# EasyEDA Pro project A320RMPv1.epro

# Board PCB8
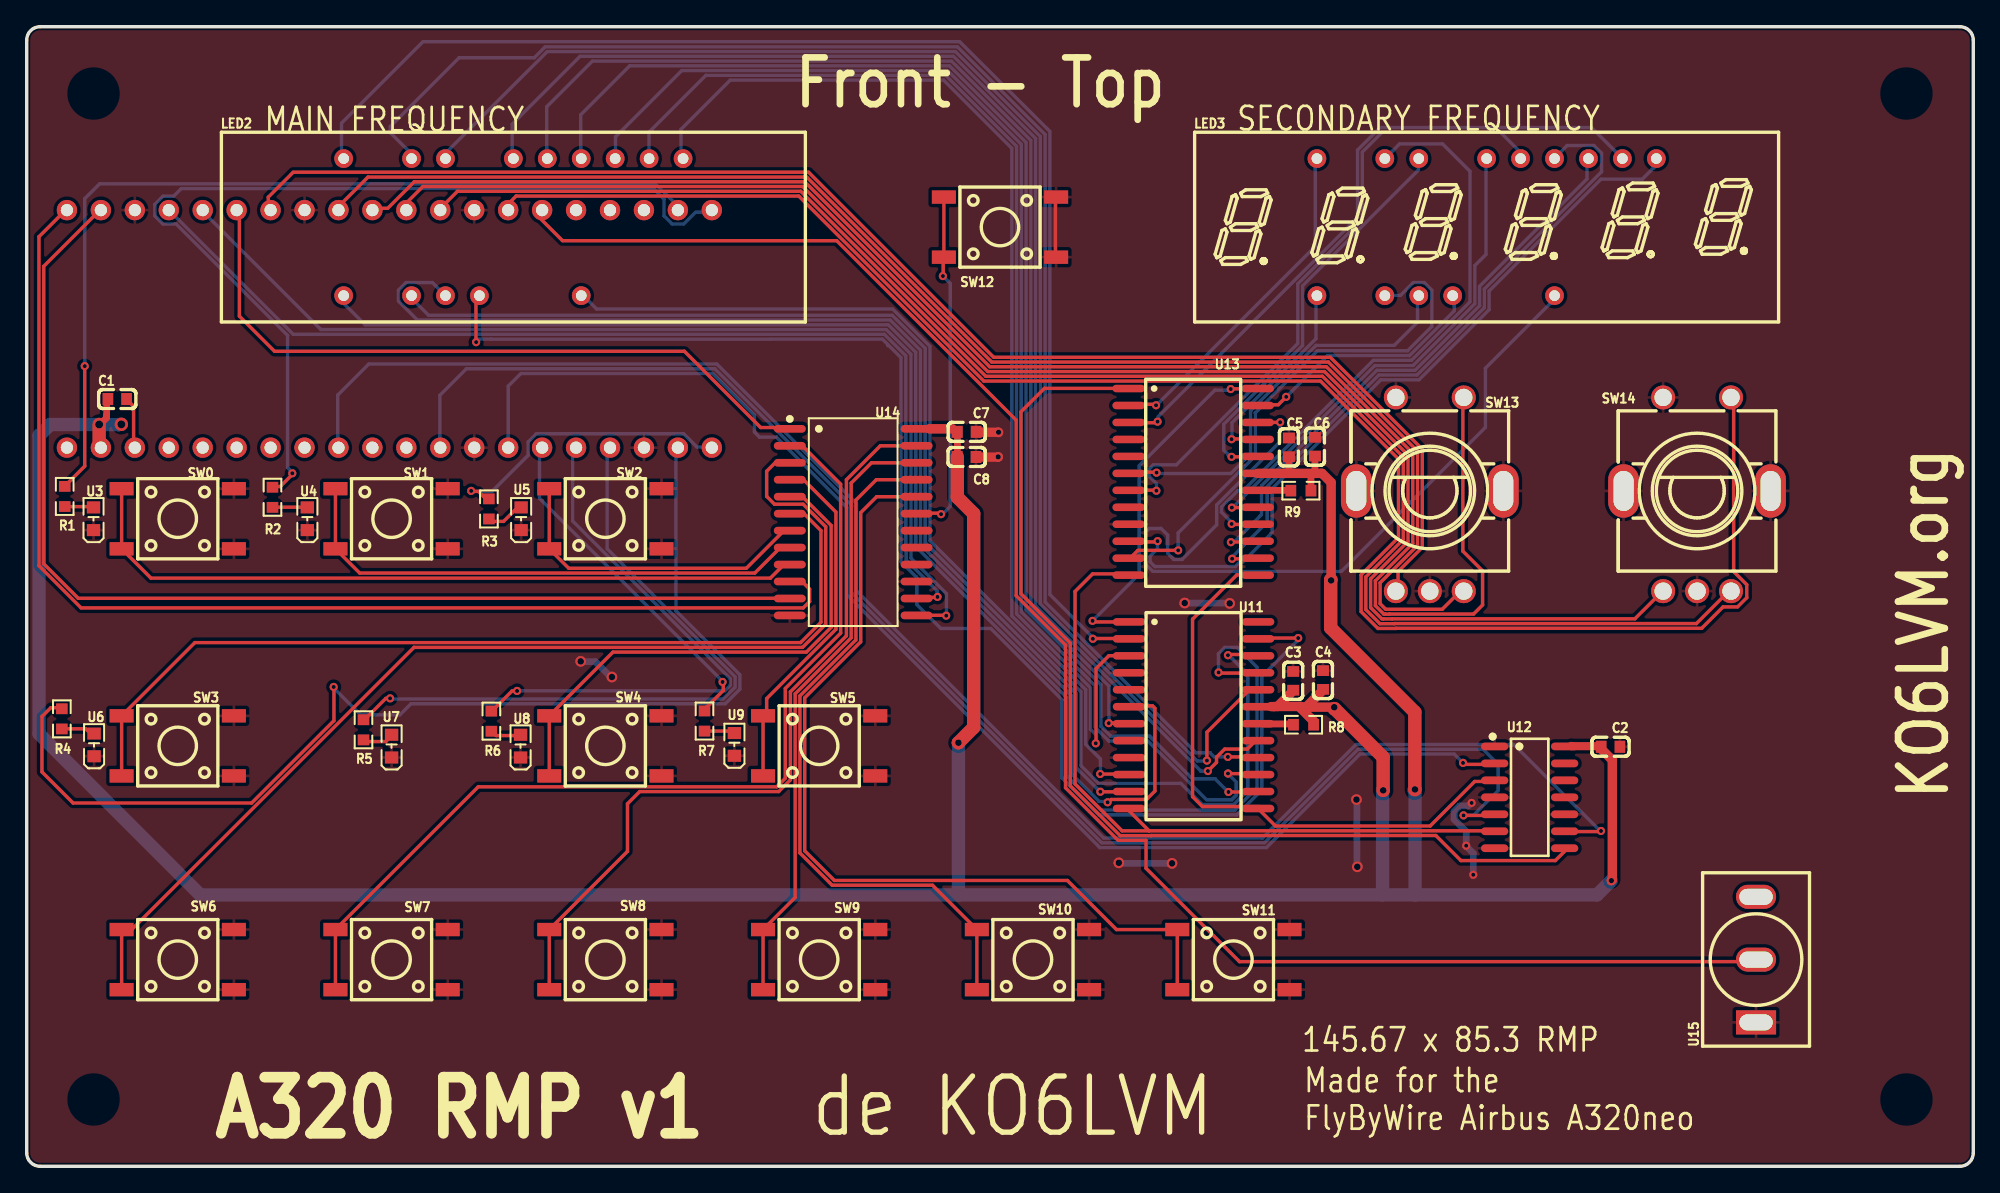
[diagram p0: board, top side]
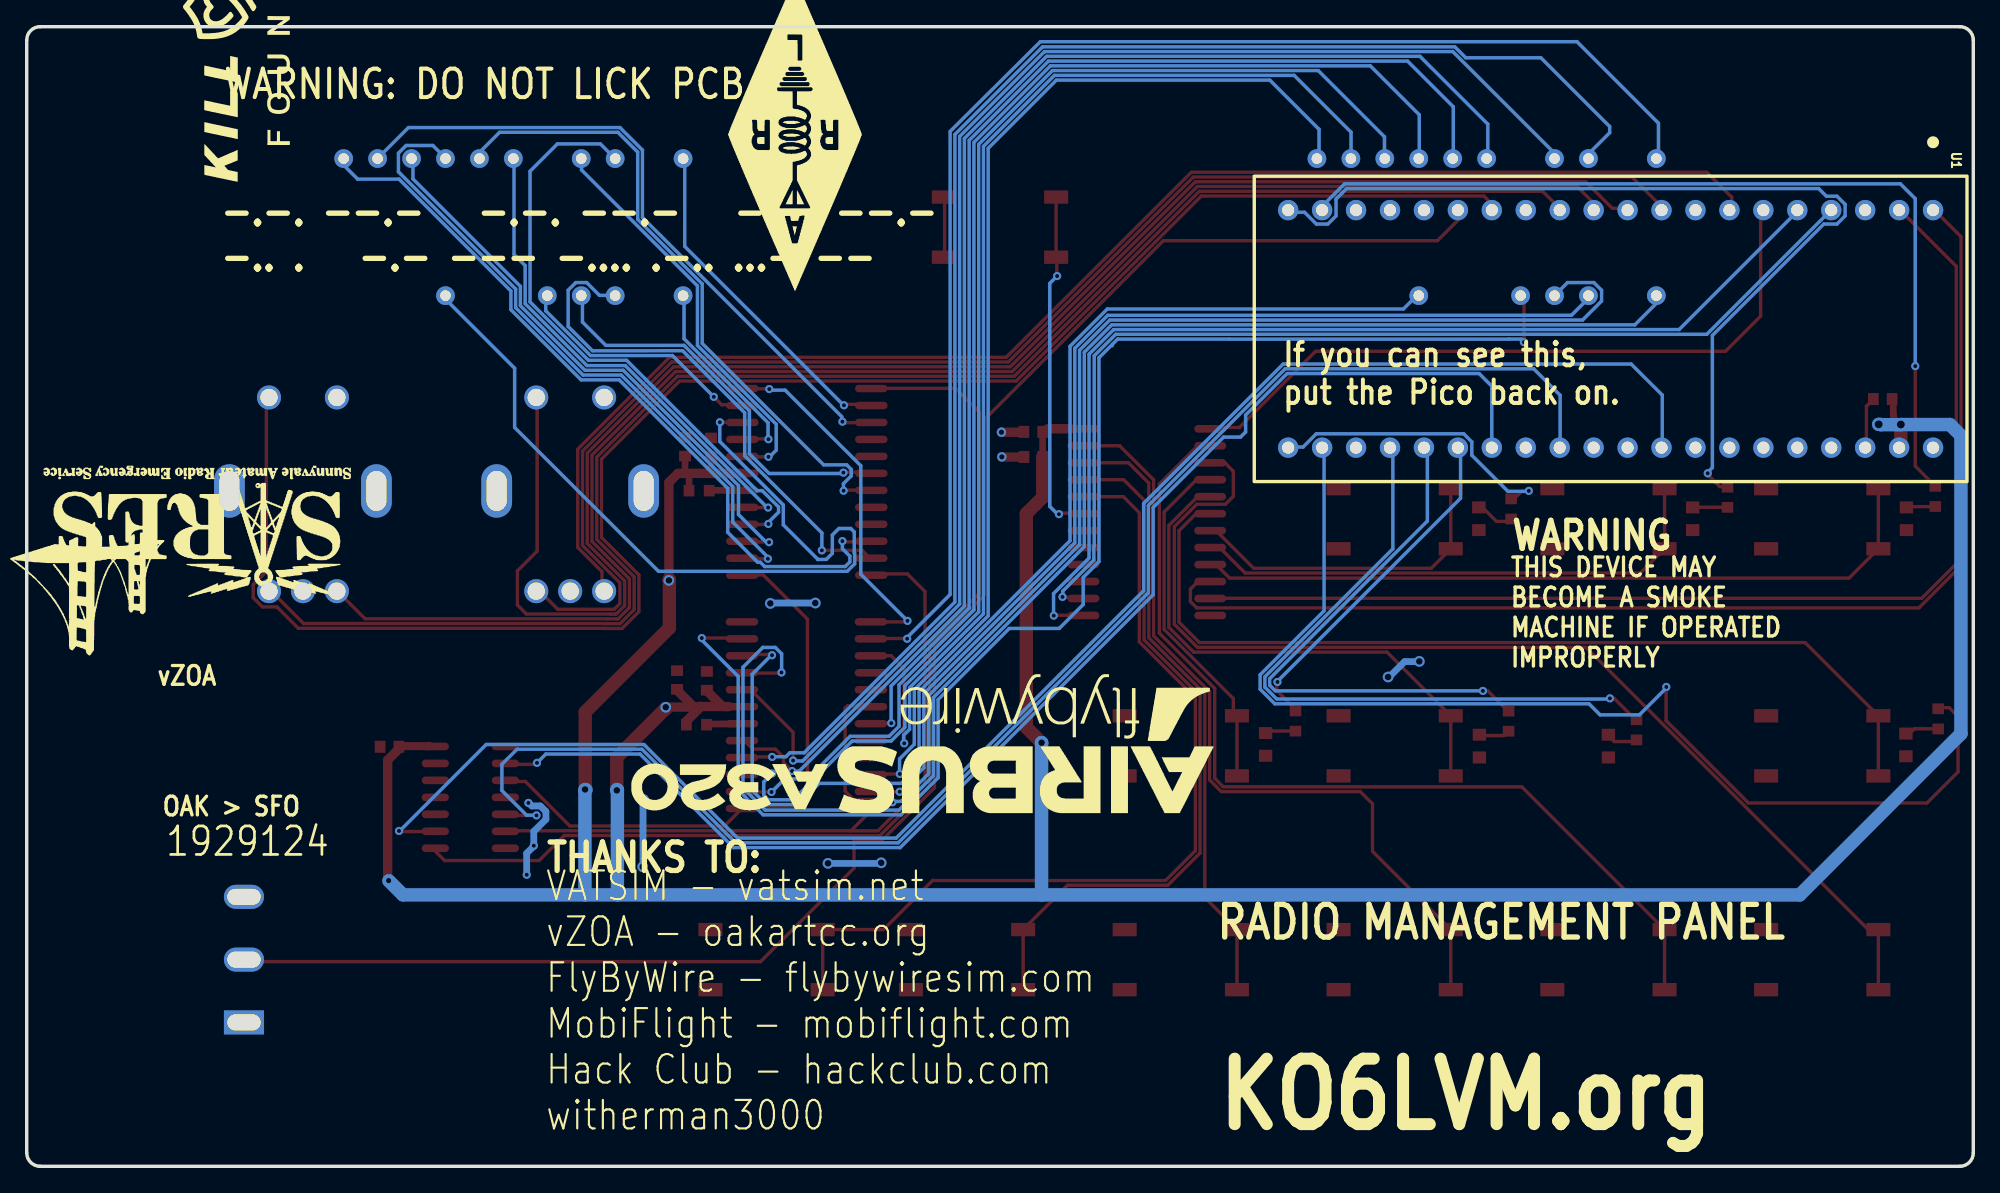
[diagram p1: board, bottom side, seen from below]

Outline 145.67 x 85.3 mm; copper layers: Top Layer, Bottom Layer. Coordinates in mm from the lower left corner of the outline.
Outline path: 0,84.3 0,1 arc(0.29,0.29) 1,0 144.67,0 arc(145.38,0.29) 145.67,1 145.67,84.3 arc(145.38,85.01) 144.67,85.3 1,85.3 arc(0.29,85.01) 0,84.3
Stack: Top Layer 0.035mm / Dielectric1 1.51mm FR4 er 4.5 / Bottom Layer 0.035mm

## Design rules (mm)
template: JLCPCB Capability(Two Layers Board)
spacing copperThickness1oz (default): track to track 0.102, other pairs 0.152 to 0.3
spacing copperThickness2oz: track to track 0.203, other pairs 0.152 to 0.3
track width copperThickness1oz (default): min 0.127, default 0.254, max 2.54
track width copperThickness2oz: min 0.203, default 0.254, max 2.54
differential pair differentialPair (default): width min 0.127, default 0.254, max 2.54; gap min 0.152, default 0.152
via viaSize (default): diameter min 0.5, default 0.61, max 10; hole min 0.3, default 0.305, max 6.3

## Placement (name value [footprint] x y rotation side)
C1  10uF  [C0603]  6.77 57.43 0 top
C2  0.1uF  [C0603]  118.52 31.4 180 top
C3  0.1uF  [C0603]  94.78 36.34 270 top
C4  10uF  [C0603]  97 36.4 270 top
C5  0.1uF  [C0603]  94.46 53.82 270 top
C6  10uF  [C0603]  96.41 53.86 270 top
C7  0.1uF  [C0603]  70.35 54.97 180 top
C8  10uF  [C0603]  70.34 53.09 180 top
LED2  FJ3661AH  [LED-SEG-TH_14P-L43.7-W14.2P2.54-S10.26-BL]  36.42 70.3 0 top
LED3  FJ3661AH  [LED-SEG-TH_14P-L43.7-W14.2P2.54-S10.26-BL]  109.25 70.3 0 top
R1  -  [R0603]  2.84 50.14 270 top
R2  -  [R0603]  18.39 50.08 270 top
R3  -  [R0603]  34.59 49.21 270 top
R4  -  [R0603]  2.63 33.49 90 top
R5  -  [R0603]  25.2 32.67 270 top
R6  -  [R0603]  34.77 33.32 270 top
R7  -  [R0603]  50.72 33.33 270 top
R8  22K  [R0603]  95.55 33.05 0 top
R9  22K  [R0603]  95.35 50.57 0 top
SW0  HX-6x6x7.3-TP FT square button  [SW-SMD_4P-L6.0-W6.0-P4.50-LS9.0-H7.3]  11.3 48.47 0 top
SW1  HX-6x6x7.3-TP FT square button  [SW-SMD_4P-L6.0-W6.0-P4.50-LS9.0-H7.3]  27.3 48.47 0 top
SW2  HX-6x6x7.3-TP FT square button  [SW-SMD_4P-L6.0-W6.0-P4.50-LS9.0-H7.3]  43.3 48.47 0 top
SW3  HX-6x6x7.3-TP FT square button  [SW-SMD_4P-L6.0-W6.0-P4.50-LS9.0-H7.3]  11.3 31.47 0 top
SW4  HX-6x6x7.3-TP FT square button  [SW-SMD_4P-L6.0-W6.0-P4.50-LS9.0-H7.3]  43.3 31.47 0 top
SW5  HX-6x6x7.3-TP FT square button  [SW-SMD_4P-L6.0-W6.0-P4.50-LS9.0-H7.3]  59.3 31.47 0 top
SW6  HX-6x6x7.3-TP FT square button  [SW-SMD_4P-L6.0-W6.0-P4.50-LS9.0-H7.3]  11.3 15.47 0 top
SW7  HX-6x6x7.3-TP FT square button  [SW-SMD_4P-L6.0-W6.0-P4.50-LS9.0-H7.3]  27.3 15.47 0 top
SW8  HX-6x6x7.3-TP FT square button  [SW-SMD_4P-L6.0-W6.0-P4.50-LS9.0-H7.3]  43.3 15.47 0 top
SW9  HX-6x6x7.3-TP FT square button  [SW-SMD_4P-L6.0-W6.0-P4.50-LS9.0-H7.3]  59.3 15.47 0 top
SW10  HX-6x6x7.3-TP FT square button  [SW-SMD_4P-L6.0-W6.0-P4.50-LS9.0-H7.3]  75.3 15.47 0 top
SW11  HX-6x6x7.3-TP FT square button  [SW-SMD_4P-L6.0-W6.0-P4.50-LS9.0-H7.3]  90.3 15.47 0 top
SW12  HX-6x6x7.3-TP FT square button  [SW-SMD_4P-L6.0-W6.0-P4.50-LS9.0-H7.3]  72.84 70.3 0 top
SW13  EC11E15244B2  [SW-TH_EC11XXXXXXXX]  105 50.3 0 top
SW14  EC11E15244B2  [SW-TH_EC11XXXXXXXX]  125 50.3 0 top
U1  -  [Raspberry Pi Pico]  25.87 61.41 270 bottom
U3  YLED0603G  [LED0603-FD]  5 48.47 270 top
U4  YLED0603G  [LED0603-FD]  21 48.47 270 top
U5  YLED0603G  [LED0603-FD]  37 48.47 270 top
U6  YLED0603G  [LED0603-FD]  5.04 31.54 270 top
U7  YLED0603G  [LED0603-FD]  27.31 31.45 270 top
U8  YLED0603G  [LED0603-FD]  36.96 31.45 270 top
U9  YLED0603G  [LED0603-FD]  52.96 31.58 270 top
U11  MAX7219M/TR  [SOP-24_L15.4-W7.5-P1.27-LS10.4-BL]  87.32 33.77 270 top
U12  SN74AHCT125DR  [SOIC-14_L8.7-W3.9-P1.27-LS6.0-BL]  112.47 27.62 270 top
U13  MAX7219M/TR  [SOP-24_L15.4-W7.5-P1.27-LS10.4-BL]  87.29 51.23 270 top
U14  CD4067BM96  [SOIC-24_L15.4-W7.5-P1.27-LS10.3-BL]  61.85 48.22 270 top
U15  MT-0-102-A101-M200-RS  [SW-TH_MT-0-103-A101-M200-RS]  129.41 15.47 90 top

## Footprints (pads in the part's own frame, mm; a bottom-side part is the same pattern mirrored in y, then rotated)
C0603
  rect 0.8x0.9 smd: 1(-0.7,0) 2(0.7,0)
LED0603-FD
  rect 0.9x1 smd: 1(-0.85,0) 2(0.85,0)
LED-SEG-TH_14P-L43.7-W14.2P2.54-S10.26-BL
  round 1.4 hole 0.8: 1(-12.7,-5.13) 3(-7.62,-5.13) 4(-5.08,-5.13) 5(-2.54,-5.13) 8(5.08,-5.13) 12(12.7,5.13) 13(10.16,5.13) 14(7.62,5.13) 15(5.08,5.13) 16(2.54,5.13) 17(0,5.13) 19(-5.08,5.13) 20(-7.62,5.13) 22(-12.7,5.13)
R0603
  rect 0.806x0.864 smd: 1(-0.753,0) 2(0.753,0)
Raspberry Pi Pico
  round 1.524 hole 0.914: 1(-10.16,22.86) 2(-10.16,20.32) 3(-10.16,17.78) 4(-10.16,15.24) 5(-10.16,12.7) 6(-10.16,10.16) 7(-10.16,7.62) 8(-10.16,5.08) 9(-10.16,2.54) 10(-10.16,0) 11(-10.16,-2.54) 12(-10.16,-5.08) 13(-10.16,-7.62) 14(-10.16,-10.16) 15(-10.16,-12.7) 16(-10.16,-15.24) 17(-10.16,-17.78) 18(-10.16,-20.32) 19(-10.16,-22.86) 20(-10.16,-25.4) 21(7.62,22.86) 22(7.62,20.32) 23(7.62,17.78) 24(7.62,15.24) 25(7.62,12.7) 26(7.62,10.16) 27(7.62,7.62) 28(7.62,5.08) 29(7.62,2.54) 30(7.62,0) 31(7.62,-2.54) 32(7.62,-5.08) 33(7.62,-7.62) 34(7.62,-10.16) 35(7.62,-12.7) 36(7.62,-15.24) 37(7.62,-17.78) 38(7.62,-20.32) 39(7.62,-22.86) 40(7.62,-25.4)
SOIC-14_L8.7-W3.9-P1.27-LS6.0-BL
  oval 0.574x2.038 smd: 1(-3.81,-2.619) 2(-2.54,-2.619) 3(-1.27,-2.619) 4(0,-2.619) 5(1.27,-2.619) 6(2.54,-2.619) 7(3.81,-2.619) 8(3.81,2.619) 9(2.54,2.619) 10(1.27,2.619) 11(0,2.619) 12(-1.27,2.619) 13(-2.54,2.619) 14(-3.81,2.619)
SOIC-24_L15.4-W7.5-P1.27-LS10.3-BL
  oval 0.574x2.388 smd: 1(-6.985,-4.744) 2(-5.715,-4.744) 3(-4.445,-4.744) 4(-3.175,-4.744) 5(-1.905,-4.744) 6(-0.635,-4.744) 7(0.635,-4.744) 8(1.905,-4.744) 9(3.175,-4.744) 10(4.445,-4.744) 11(5.715,-4.744) 12(6.985,-4.744) 13(6.985,4.744) 14(5.715,4.744) 15(4.445,4.744) 16(3.175,4.744) 17(1.905,4.744) 18(0.635,4.744) 19(-0.635,4.744) 20(-1.905,4.744) 21(-3.175,4.744) 22(-4.445,4.744) 23(-5.715,4.744) 24(-6.985,4.744)
SOP-24_L15.4-W7.5-P1.27-LS10.4-BL
  oval 0.56x2.432 smd: 1(-6.985,-4.826) 2(-5.715,-4.826) 3(-4.445,-4.826) 4(-3.175,-4.826) 5(-1.905,-4.826) 6(-0.635,-4.826) 7(0.635,-4.826) 8(1.905,-4.826) 9(3.175,-4.826) 10(4.445,-4.826) 11(5.715,-4.826) 12(6.985,-4.826) 13(6.985,4.826) 14(5.715,4.826) 15(4.445,4.826) 16(3.175,4.826) 17(1.905,4.826) 18(0.635,4.826) 19(-0.635,4.826) 20(-1.905,4.826) 21(-3.175,4.826) 22(-4.445,4.826) 23(-5.715,4.826) 24(-6.985,4.826)
SW-SMD_4P-L6.0-W6.0-P4.50-LS9.0-H7.3
  rect 1.8x1 smd: 1(-4.2,2.25) 2(4.2,2.25) 3(-4.2,-2.25) 4(4.2,-2.25)
SW-TH_EC11XXXXXXXX
  oval 2.3x4 hole 1.5x3: 6(5.5,0.25) 7(-5.5,0.25)
  round 1.8 hole 1.3: A(-2.54,-7.25) B(2.54,-7.25) C(0,-7.25) D(-2.54,7.25) E(2.54,7.25)
SW-TH_MT-0-103-A101-M200-RS
  rect 1.8x3 hole 1.2x2.5: 1(-4.7,0)
  oval 1.8x3 hole 1.2x2.5: 2(0,0) 3(4.7,0)

## Nets
GND: C2.1 C3.1 C4.1 C5.1 C6.1 C7.1 C8.1 SW0.2 SW0.4 SW1.2 SW1.4 SW2.2 SW2.4 SW3.2 SW3.4 SW4.2 SW4.4 SW5.2 SW5.4 SW6.2 SW6.4 SW7.2 SW7.4 SW8.2 SW8.4 SW9.2 SW9.4 SW10.2 SW10.4 SW11.2 SW11.4 SW12.2 SW12.4 SW13.6 SW13.7 SW13.C SW13.D SW14.6 SW14.7 SW14.C SW14.D U1.3 U1.8 U1.13 U1.33 U1.38 U3.2 U4.2 U5.2 U6.2 U7.2 U8.2 U9.2 U11.4 U11.9 U12.1 U12.4 U12.7 U12.10 U13.4 U13.9 U14.12 U14.15 U15.1
VBUS: C1.1 C2.2 C3.2 C4.2 C5.2 C6.2 C7.2 C8.2 R8.2 R9.2 U1.22 U11.19 U12.14 U13.19 U14.24
$1N3202: R2.2 U4.1
$1N3228: R3.2 U5.1
$1N3254: R4.1 U6.1
$1N3280: R5.2 U7.1
$1N3332: R1.2 U3.1
$1N3406: R7.2 U9.1
$1N3410: R1.1 U1.19
$1N3423: R3.1 U1.40
$1N3432: R4.2 U1.39
$1N3454: R5.1 U1.37
$1N3465: R6.2 U8.1
$1N3469: R6.1 U1.36
$1N4750: LED2.22 U11.2
$1N4766: LED2.3 U11.11
$1N5784: LED2.4 U11.6
$1N5806: LED2.15 U11.14
$1N5817: LED2.14 U11.15
$1N5851: LED2.20 U11.16
$1N5859: LED2.17 U11.17
$1N5890: LED2.8 U11.22
$1N5896: LED2.5 U11.23
$1N5930: LED2.12 U11.10
$1N5937: LED2.16 U11.7
$1N5945: LED2.13 U11.3
$1N6010: R7.1 U1.35
$1N7267: R8.1 U11.18
$1N7962: LED3.17 U13.17
$1N7964: LED3.3 U13.11
$1N7965: R9.1 U13.18
$1N7967: LED3.14 U13.15
$1N7968: LED3.13 U13.3
$1N7969: LED3.12 U13.10
$1N7970: LED3.20 U13.16
$1N7971: LED3.19 U13.20
$1N7972: LED3.16 U13.7
$1N7973: LED3.15 U13.14
$1N7974: LED3.4 U13.6
$1N7975: LED3.8 U13.22
$1N7976: LED3.5 U13.23
$1N7977: LED3.22 U13.2
$1N7982: LED3.1 U13.21
$1N7987: U11.1 U13.24
$1N8039: U1.34 U12.2
$1N8109: U11.13 U12.3 U13.13
$1N8174: U1.32 U12.5
$1N8194: U11.12 U12.6 U13.12
$1N8236: R2.1 U1.20
$1N10304: SW0.1 SW0.3 U14.9
$1N10314: SW1.1 SW1.3 U14.8
$1N10327: SW2.1 SW2.3 U14.7
$1N10335: SW3.1 SW3.3 U14.6
$1N10362: SW4.1 SW4.3 U14.5
$1N10372: SW5.1 SW5.3 U14.4
$1N10380: SW6.1 SW6.3 U14.3
$1N10461: SW7.1 SW7.3 U14.2
$1N10477: SW8.1 SW8.3 U14.23
$1N10484: SW9.1 SW9.3 U14.22
$1N10492: SW10.1 SW10.3 U14.21
$1N10503: SW11.1 SW11.3 U14.20
$1N10511: SW12.1 SW12.3 U14.19
$1N10621: U1.1 U14.10
$1N10626: U1.2 U14.11
$1N12113: SW13.E U1.10
$1N12181: U1.6 U14.1
$1N12203: U1.5 U14.13
$1N12212: U1.4 U14.14
$1N12220: SW13.B U1.9
$1N12226: SW13.A U1.7
$1N12246: SW14.A U1.11
$1N12253: SW14.B U1.12
$1N12279: SW14.E U1.14
$1N12374: U1.15 U15.2
$1N15775: U1.29 U12.9
$1N15829: U12.8 U13.1
$1N18174: C1.2 U1.23
$1N23285: LED2.19 U11.20
$1N23296: LED2.1 U11.21

Pads without a net: U1 16 17 18 21 24 25 26 27 28 30 31; U11 5 8 24; U12 11 12 13; U13 5 8; U14 16 17 18; U15 3

## Via types
v1: diameter 0.7, hole 0.4, Top Layer to Bottom Layer, 3 vias
v2: diameter 1, hole 0.6, Top Layer to Bottom Layer, 2 vias
v3: diameter 1, hole 0.5, Top Layer to Bottom Layer, 3 vias
v4: diameter 0.8, hole 0.5, Top Layer to Bottom Layer, 10 vias
v5: diameter 0.61, hole 0.305, Top Layer to Bottom Layer, 48 vias

## Routing (per net, layer and track width the routed paths; a pad name or vN(x,y) marks a point on that pad's centre or on a via; arc(x,y) is an arc through that point)
GND: length 29.7
  Top Layer w0.254: 76.98,72.59 76.98,68.1
  Top Layer w0.7: 71.08,53.09 72.7,53.09 72.71,53.1 ; 71.08,54.95 72.69,54.95 72.71,54.92
  Bottom Layer w0.5: v4(86.66,42.16) 89.95,42.16 ; 107.72,23.95 107.72,23.96 ; 107.72,23.96 108.25,23.43 108.25,21.85 ; 107.72,23.96 107.71,23.97 ; 81.68,22.67 85.66,22.67 85.73,22.74 ; 108.13,27.23 107.87,26.97 107.23,26.97 106.82,26.56 106.82,25.97 107.72,25.06 107.72,23.97 ; 43.7,36.64 42.56,37.78 41.46,37.78 ; 99.55,27.46 99.55,22.49
  vias: v1(72.73,54.95) v1(72.7,53.1) v4(41.46,37.79) v4(43.79,36.62) v4(81.73,22.72) v4(85.71,22.68) v4(90.02,42.13) v4(99.51,27.45) v4(99.57,22.42) v5(107.72,24) v5(108.13,27.2) v5(108.25,21.82)
VBUS: length 273.9
  Top Layer w0.5: C7.2 69.65,53.1 C8.2 ; C5.2 94.46,51.9 94.42,51.87 ; 5.46,55.51 5.98,56.03 5.98,56.21 5.98,56.21 5.98,57.45 ; 96.1,50.57 96.1,51.61 96.41,51.91 C6.2
  Top Layer w0.6: 117.62,31.47 117.6,31.45 115.59,31.45 115.59,31.47
  Top Layer w0.7: 93.6,34.42 93.34,34.41 93.12,34.41 ; 93.6,34.42 95.34,34.42 95.39,34.37 97.84,34.37 ; 93.6,34.42 94.8,35.61 ; 95.81,34.45 96.99,35.62 ; U13.19 96.93,51.87 97.61,51.19 v4(97.61,43.85) ; v1(118.59,21.38) 118.66,21.46 118.66,30.4 117.67,31.39 ; 69.57,54.9 69.61,54.87 ; 96.31,33.09 96.31,33.31 95.21,34.41 ; 67.54,55.21 69.27,55.21
  Top Layer w1: 101.51,28.14 101.51,30.62 97.89,34.24 97.84,34.24 ; 103.88,28.19 103.88,34 97.58,40.29 97.58,43.9 97.61,43.9 ; C8.2 69.64,50.08 70.87,48.85 70.87,32.85 v3(69.72,31.71) ; 5.42,53.92 5.42,55.27
  Bottom Layer w1: 5.39,55.51 6.93,55.51 6.94,55.53 ; 118.57,21.37 117.51,20.32 103.9,20.32 ; 101.47,20.32 103.9,20.32 ; 103.9,20.32 103.9,28.1 103.81,28.18 ; 101.47,20.32 101.47,28.16 101.51,28.2 ; v3(69.72,31.71) 69.73,31.7 69.73,20.31 ; 5.33,55.52 1.75,55.52 0.92,54.7 0.92,32.38 12.99,20.31 69.73,20.31 ; 69.73,20.31 101.43,20.32
  vias: v2(5.42,55.53) v2(7.08,55.54) v3(101.51,28.14) v3(103.89,28.21) v4(97.85,34.36)
$1N3202: length 2.6
  Top Layer w0.254: 18.37,49.33 20.86,49.33 20.9,49.29
$1N3228: length 3
  Top Layer w0.254: 34.55,48.27 35.68,48.27 36.97,49.56
$1N3254: length 2.1
  Top Layer w0.254: 2.68,32.75 4.41,32.75 4.67,32.48
$1N3280: length 2.4
  Top Layer w0.254: 25.36,31.79 26.87,31.79 27.51,32.43
$1N3332: length 2.3
  Top Layer w0.254: 2.8,49.38 5,49.38 5.05,49.42
$1N3406: length 2.2
  Top Layer w0.254: 50.61,32.58 52.71,32.58 52.79,32.5
$1N3410: length 67.8
  Top Layer w0.254: v5(4.34,59.9) 4.34,52.41 2.84,50.9
  Bottom Layer w0.254: v5(4.34,59.9) 4.34,72.43 5.45,73.54 47.05,73.54 48.67,71.91 48.81,71.91
$1N3423: length 22.2
  Top Layer w0.254: 33.24,50.52 33.8,50.52 34.45,49.87
  Bottom Layer w0.254: 33.39,50.52 34.82,50.52 37.53,53.23 37.53,54.22 38.14,54.83 49.16,54.83 50.15,53.84 51.29,53.84
  vias: v5(33.26,50.55)
$1N3432: length 85.6
  Top Layer w0.254: 22.99,35.87 22.99,33.36 16.83,27.19 3.47,27.19 1.14,29.52 1.14,33.67 1.8,34.33 2.43,34.33
  Bottom Layer w0.254: 48.58,53.77 48.58,41.58 53.37,36.79 53.37,35.72 52.27,34.62 28.75,34.62 27.93,33.79 24.98,33.79 22.98,35.79
  vias: v5(22.97,35.88)
$1N3454: length 50.7
  Top Layer w0.254: v5(27.19,35.03) 26.87,35.03 25.36,33.51
  Bottom Layer w0.254: 43.44,53.97 43.44,46.22 53.01,36.64 53.01,35.86 52.12,34.98 27.23,34.98
$1N3465: length 2.4
  Top Layer w0.254: 34.71,32.66 35.12,32.24 36.92,32.24
$1N3469: length 41.5
  Top Layer w0.254: 36.77,35.58 36.32,35.58 34.86,34.12
  Bottom Layer w0.254: 40.85,53.95 40.85,48.3 52.66,36.5 52.66,36.01 52.24,35.59 36.91,35.59 36.75,35.75 ; 41.12,53.97 41.14,53.94
  vias: v5(36.69,35.58)
$1N4750: length 101.7
  Top Layer w0.254: 79.77,39.51 81.42,39.51 81.47,39.45
  Bottom Layer w0.254: 76.57,77.45 76.57,42.8 79.87,39.5 ; 76.56,77.47 69.81,84.18 29.66,84.18 23.56,78.08 23.56,75.76
  vias: v5(79.78,39.49)
$1N4766: length 80.6
  Top Layer w0.254: 80.38,28.04 82.13,28.04 82.15,28.06
  Bottom Layer w0.254: 28.71,65.11 28.71,65.06 30.07,63.7 64.77,63.7 67.24,61.23 67.24,46.67 78.53,35.38 78.53,29.84 80.25,28.12 80.42,28.12
  vias: v5(80.35,28.04)
$1N5784: length 97.3
  Top Layer w0.254: 80.93,27.22 81.16,27.46 81.64,27.46 ; 82.41,34.47 84.25,34.47 84.43,34.29 84.43,28.08 83.8,27.46 81.68,27.46
  Bottom Layer w0.254: 31.09,65.42 30.36,66.15 28.39,66.15 27.82,65.58 27.82,64.76 29.24,63.34 64.62,63.34 66.88,61.08 66.88,46.53 78.18,35.23 78.18,29.38 80.24,27.31 80.91,27.31
  vias: v5(80.89,27.25)
$1N5806: length 101
  Top Layer w0.254: v5(89.93,28.02) 92.87,28.02 92.92,27.96
  Bottom Layer w0.254: 41.46,75.53 41.46,78.71 45.12,82.37 69.06,82.37 74.79,76.64 74.79,41.64 80.39,36.04 80.39,32.93 81.13,32.19 84.04,32.19 87.23,29 88.94,29 89.88,28.06
$1N5817: length 99.5
  Top Layer w0.254: v5(89.9,29.4) 89.9,29.39 92.39,29.39
  Bottom Layer w0.254: 89.9,29.38 90.52,28.77 90.52,27.78 90.17,27.43 88.29,27.43 83.9,31.83 80.98,31.83 79.96,32.86 79.96,35.97 74.43,41.5 74.43,76.5 68.91,82.02 49.02,82.02 44.06,77.06 44.06,75.52
$1N5851: length 113.1
  Top Layer w0.254: v5(89.89,30.64) 92.65,30.64 92.65,30.64
  Bottom Layer w0.254: 89.92,30.66 88.85,30.66 88.56,30.95 87.49,30.95 76.21,42.23 76.21,77.23 69.65,83.8 38.8,83.8 37.98,82.97 32.35,82.97 27.21,77.83 27.21,77.36 28.77,75.81
$1N5859: length 104.3
  Top Layer w0.254: 91.95,31.84 91.34,31.23 89.65,31.23 89.04,30.62 89.04,30.23 v5(88.39,29.59)
  Bottom Layer w0.254: 36.33,75.25 36.33,78.01 41.41,83.08 69.35,83.08 75.5,76.94 75.5,41.94 87.86,29.58 88.36,29.58
$1N5890: length 90.6
  Top Layer w0.254: 89.84,38.31 91.77,38.31 91.79,38.33
  Bottom Layer w0.254: 89.93,38.28 91.37,36.83 91.37,28.13 90.32,27.08 87.95,27.08 86.37,28.66 80.21,28.66 78.89,29.98 78.89,35.52 67.59,46.82 67.59,61.38 64.8,64.17 42.65,64.17 41.51,65.31
  vias: v5(89.9,38.25)
$1N5896: length 107.8
  Top Layer w0.254: 33.86,65.2 33.62,64.96 33.62,61.68 ; 91.79,39.38 91.62,39.54 v5(95.15,39.54)
  Bottom Layer w0.254: 55.7,61.92 64.03,61.92 64.44,61.51 64.44,61.42 ; 33.65,61.73 33.84,61.92 34.75,61.92 34.76,61.91 55.67,61.91 ; 64.49,61.47 65.43,60.52 65.43,45.26 66.61,44.08 66.61,42.05 68.4,40.26 72.14,40.26 77.47,34.94 77.47,29.08 80.24,26.31 90.56,26.31 92.43,28.17 92.43,36.67 95.26,39.5
  vias: v5(33.63,61.69)
$1N5930: length 81.9
  Top Layer w0.254: 80.34,29.36 81.98,29.36 82.06,29.29
  Bottom Layer w0.254: 48.96,75.43 48.96,77.62 52.64,81.3 68.62,81.3 73.72,76.2 73.72,41.2 79.25,35.67 79.25,31.59 80.35,30.49 80.35,29.42
  vias: v5(80.33,29.37)
$1N5937: length 90.9
  Top Layer w0.254: 82.11,33.11 82.05,33.17 v5(80.97,33.17)
  Bottom Layer w0.254: v5(80.97,33.17) 80.99,33.18 80.99,35.95 75.14,41.79 75.14,76.79 69.21,82.73 42.34,82.73 38.91,79.3 38.91,75.68
$1N5945: length 88.6
  Top Layer w0.254: 79.98,31.68 80.02,31.73 80.02,37.26 80.98,38.22 82.41,38.22
  Bottom Layer w0.254: 80.05,31.62 80.05,32.26 79.6,32.71 79.6,35.82 74.07,41.35 74.07,76.35 68.76,81.66 50.82,81.66 46.57,77.4 46.57,75.82
  vias: v5(80,31.66)
$1N6010: length 26
  Top Layer w0.254: 52.13,36.33 52.13,35.61 50.61,34.1
  Bottom Layer w0.254: 38.37,53.65 38.37,50 52.14,36.23
  vias: v5(52.07,36.25)
$1N7267: length 2.3
  Top Layer w0.5: 94.76,33.07 94.72,33.11 92.51,33.11
$1N7962: length 37.4
  Top Layer w0.254: 91.59,49.27 91.55,49.31 90.31,49.31
  Bottom Layer w0.254: 109.2,75.73 109.2,68.26 108.37,67.42 108.37,64.57 103.74,59.94 100.89,59.94 90.15,49.21
  vias: v5(90.19,49.31)
$1N7964: length 39.2
  Top Layer w0.254: 82.54,45.48 83.16,46.1 v5(86.17,46.1)
  Bottom Layer w0.254: 101.74,65.19 102.81,65.19 103.77,66.15 104.58,66.15 105.15,65.58 105.15,62.86 103.34,61.04 96.59,61.05 91.94,56.4 91.94,53.19 86.17,47.41 v5(86.17,46.1)
$1N7965: length 2.5
  Top Layer w0.5: U13.18 94.57,50.6 R9.1
$1N7967: length 42.5
  Top Layer w0.254: 90.12,46.73 91.34,46.73 91.38,46.77
  Bottom Layer w0.254: 116.77,75.27 116.77,73.91 108.73,65.87 108.73,64.42 103.89,59.58 101.03,59.58 92.4,50.95 92.4,48.79 90.27,46.65
  vias: v5(90.12,46.72)
$1N7968: length 49.8
  Top Layer w0.254: 83.06,55.66 84.56,55.66 84.57,55.65
  Bottom Layer w0.254: 84.68,55.81 84.68,56.12 99.59,71.03 99.59,76.07 101.28,77.75 117.1,77.75 119.65,75.21
  vias: v5(84.63,55.74)
$1N7969: length 57.8
  Top Layer w0.254: v5(84.63,46.8) 84.57,46.74 82.5,46.74
  Bottom Layer w0.254: 121.92,75.57 121.92,74.91 120.9,73.89 117.81,73.89 109.44,65.52 109.44,64.12 104.19,58.87 101.33,58.87 93.21,50.75 93.21,47.46 90.97,45.21 90.77,45.21 90.45,44.89 84.42,44.89 84.07,45.24 84.07,45.67 84.63,46.23 v5(84.63,46.8)
$1N7970: length 45.2
  Top Layer w0.254: 90.22,48.05 91.45,48.05 91.48,48.08
  Bottom Layer w0.254: 90.18,48.19 89.41,48.96 89.41,49.35 90.63,50.58 91.02,50.58 100.78,60.33 103.63,60.33 108.01,64.71 108.01,74.48 105.96,76.53 102.74,76.53 101.59,75.38
  vias: v5(90.17,48.08)
$1N7971: length 29.7
  Top Layer w0.254: v5(90.16,53.1) 91.31,53.1 91.37,53.16
  Bottom Layer w0.254: 104.15,75.27 104.15,74.58 95.48,65.9 95.48,61.45 89.58,55.55 89.58,53.6 90.09,53.09
$1N7972: length 48.4
  Top Layer w0.254: 82.58,50.61 84.41,50.61 84.51,50.5
  Bottom Layer w0.254: 84.55,50.55 84.55,51.09 83.97,51.68 83.97,52.16 84.31,52.5 86.03,52.5 95.12,61.59 95.12,66.05 99.95,70.88 99.95,75.92 101.43,77.4 110.29,77.4 111.84,75.84
  vias: v5(84.54,50.57)
$1N7973: length 48.9
  Top Layer w0.254: 90.22,45.47 91.59,45.47 91.64,45.42
  Bottom Layer w0.254: 114.43,75.57 115.27,76.41 117.28,76.41 117.85,75.84 117.85,74.44 109.08,65.67 109.08,64.27 104.04,59.23 101.18,59.23 92.84,50.88 92.84,48.22 90.12,45.51
  vias: v5(90.2,45.47)
$1N7974: length 29.9
  Top Layer w0.254: 84.49,51.93 84.46,51.96 82.54,51.96
  Bottom Layer w0.254: 84.64,51.86 90.11,51.86 91.59,53.33 91.59,56.55 96.49,61.45 102.34,61.45 104.08,63.19 104.08,65.07
  vias: v5(84.55,51.92)
$1N7975: length 64.3
  Top Layer w0.254: 92.15,55.68 93.81,55.68 93.86,55.73
  Bottom Layer w0.254: 93.81,55.67 93.81,54.25 89.05,49.5 89.05,48.01 86.46,45.42 ; 86.46,45.42 85.84,45.42 85.38,45.88 85.38,47.25 84.88,47.75 ; 86.46,45.42 86.47,45.42 ; 86.46,45.42 86.46,45.42 ; 84.86,47.74 84.01,47.74 83.74,47.48 83.74,45.9 83.71,45.87 83.71,45.09 84.27,44.53 98.39,44.53 109.16,55.31 109.16,59.74 114.61,65.18
  vias: v5(93.8,55.69)
$1N7976: length 18.7
  Top Layer w0.254: 92.36,57 93.66,57 v5(94.25,57.6)
  Bottom Layer w0.254: 106.83,65.34 106.83,64.03 103.49,60.69 97.35,60.69 v5(94.25,57.6)
$1N7977: length 25.9
  Top Layer w0.254: 82.4,57.04 84.55,57.04 84.6,56.98
  Bottom Layer w0.254: 96.43,75.68 96.43,68.86 84.51,56.94
  vias: v5(84.51,56.96)
$1N7982: length 15
  Top Layer w0.254: 91.64,54.27 91.46,54.45 90.16,54.45
  Bottom Layer w0.254: 96.48,65.26 96.48,61.95 90.19,55.66 90.19,54.44
  vias: v5(90.16,54.42)
$1N7987: length 26.1
  Top Layer w0.254: 82.29,40.77 82.26,40.75 79.79,40.75 ; 90.1,58.2 91.53,58.2 91.56,58.17
  Bottom Layer w0.254: 90.02,58.09 88.91,58.09 83.25,52.44 83.25,44.33 79.81,40.88
  vias: v5(79.76,40.83) v5(90.1,58.18)
$1N8039: length 101.2
  Top Layer w0.254: 109.76,30.09 107.61,30.09 107.47,30.23
  Bottom Layer w0.254: 36.03,53.92 36.03,58.4 36.98,59.34 51.35,59.34 54.46,56.23 54.46,54.96 54.84,54.58 56.1,54.58 61.38,49.31 61.38,42.78 80.3,23.85 92.77,23.85 99.77,30.86 106.82,30.86 107.55,30.13
  vias: v5(107.49,30.2)
$1N8109: length 43.8
  Top Layer w0.254: 92.23,26.69 93.45,25.47 105.03,25.47 108.36,28.8 109.97,28.8 ; 92.28,26.93 87.98,26.93 87.25,27.67 87.25,40.96 90.56,44.27 91.44,44.27
$1N8174: length 113.2
  Top Layer w0.254: 109.52,26.28 109.51,26.26 107.51,26.26
  Bottom Layer w0.254: 30.92,53.84 30.92,57.72 32.9,59.7 51.49,59.7 61.73,49.46 61.73,42.93 80.45,24.21 92.62,24.21 99.63,31.22 108.98,31.22 110.11,30.08 110.11,28.13 108.27,26.28 107.43,26.28
  vias: v5(107.52,26.26)
$1N8194: length 54
  Top Layer w0.254: 84,25.11 81.97,25.11 78.45,28.63 78.45,43.03 79.77,44.34 82.42,44.34 ; 84,25.11 82.42,26.68 ; 84,25.11 84,25.12 109.79,25.12 109.84,25.07
$1N8236: length 71.2
  Top Layer w0.254: 19.98,51.89 18.97,50.88 18.36,50.88
  Bottom Layer w0.254: 19.9,51.92 19.52,52.3 19.52,62.19 11.18,70.53 10.2,70.53 9.59,71.14 9.59,72 10.2,72.61 10.99,72.61 11.56,73.18 46.9,73.18 47.69,72.39 47.69,71.14 48.3,70.53 49.16,70.53 50.04,71.41 51.17,71.41
  vias: v5(19.87,51.87)
$1N10304: length 55.8
  Top Layer w0.254: SW0.1 SW0.3 9.3,44.03 55.65,44.03 56.67,45.04 U14.9
$1N10314: length 40
  Top Layer w0.254: U14.8 56.39,46.31 54.48,44.41 24.92,44.41 SW1.3 SW1.1
$1N10327: length 24.3
  Top Layer w0.254: U14.7 56.67,47.58 53.85,44.76 40.56,44.76 SW2.3 SW2.1
$1N10335: length 69.4
  Top Layer w0.254: SW3.3 SW3.1 12.58,39.2 57.91,39.2 59.44,40.72 59.44,47.58 58.17,48.85 U14.6
$1N10362: length 39.9
  Top Layer w0.254: U14.5 58.05,50.12 60.2,47.97 60.2,40.34 58.34,38.49 43.87,38.49 SW4.1 SW4.3
$1N10372: length 26.5
  Top Layer w0.254: SW5.3 SW5.1 55.37,33.99 55.37,35.01 60.55,40.19 60.55,48.97 58.13,51.39 U14.4
$1N10380: length 83.2
  Top Layer w0.254: U14.3 56.01,52.66 55.37,52.03 55.37,50.15 55.96,49.56 58.11,49.56 59.79,47.87 59.79,40.58 58.06,38.84 28.98,38.84 7.86,17.72 SW6.1 SW6.3
$1N10461: length 71.6
  Top Layer w0.254: U14.2 58.04,53.93 60.91,51.06 60.91,39.91 56.77,35.77 56.77,29.05 56.13,28.4 33.79,28.4 SW7.1 SW7.3
$1N10477: length 59.8
  Top Layer w0.254: SW8.3 SW8.1 44.96,23.58 44.96,27.13 45.87,28.05 56.27,28.05 57.15,28.92 57.15,35.52 61.34,39.71 61.34,51.39 63.88,53.93 U14.23
$1N10484: length 46.2
  Top Layer w0.254: SW9.3 SW9.1 57.51,20.12 57.51,35.37 61.7,39.56 61.7,51.14 63.22,52.66 U14.22
$1N10492: length 53.4
  Top Layer w0.254: U14.21 63.58,51.39 62.05,49.87 62.05,39.4 57.86,35.21 57.86,23.45 60.28,21.04 67.78,21.04 SW10.1 SW10.3
$1N10503: length 66.6
  Top Layer w0.254: U14.20 63.61,50.12 62.41,48.92 62.41,39.26 58.22,35.06 58.22,23.61 60.44,21.39 77.88,21.39 81.55,17.72 SW11.1 SW11.3
$1N10511: length 25.7
  Top Layer w0.254: 66.81,48.89 68.35,48.89 68.42,48.81 ; SW12.1 SW12.3 ; 68.63,66.78 68.59,66.83 68.59,68.03
  Bottom Layer w0.254: 68.47,48.75 69.11,49.4 69.11,66.09 68.61,66.59
  vias: v5(68.42,48.81) v5(68.56,66.64)
$1N10621: length 89.2
  Top Layer w0.254: 57.17,43.82 57.97,43.82 58.59,43.2 58.59,42.28 58.11,41.8 4.07,41.8 0.92,44.95 0.92,69.58 2.87,71.54
$1N10626: length 85.4
  Top Layer w0.254: 5.61,71.81 5.61,71.71 1.27,67.37 1.27,45.1 3.85,42.51 57.05,42.51
$1N12113: length 124.8
  Top Layer w0.254: 25.65,71.71 27.02,71.71 29,73.69 58.22,73.69 72.07,59.84 97.26,59.84 103.72,53.38 103.72,46.62 100.93,43.82 100.93,41.96 101.55,41.34 101.66,41.34 101.67,41.33 101.96,41.33 101.97,41.34 108.27,41.34 108.95,42.01 108.95,44.57 107.47,46.05 107.47,57.7
$1N12181: length 53.1
  Top Layer w0.254: 15.91,71.56 15.91,63.64 18.54,61.01 49.22,61.01 54.93,55.3 57.47,55.3 57.58,55.19
$1N12203: length 80.2
  Top Layer w0.254: 66.59,41.24 68.69,41.24 68.71,41.26
  Bottom Layer w0.254: 68.83,41.24 68.83,42.87 66.17,45.52 66.17,60.79 64.33,62.63 22.01,62.63 13.2,71.45
  vias: v5(68.81,41.22)
$1N12212: length 80.2
  Top Layer w0.254: 66.45,42.59 68.12,42.59 v5(68.16,42.62)
  Bottom Layer w0.254: 68.14,42.65 68.14,43.05 65.81,45.38 65.81,46.4 65.78,46.43 65.78,60.67 64.18,62.27 19.94,62.27 10.74,71.48
$1N12220: length 109.8
  Top Layer w0.254: 107.48,43.24 105.93,41.69 101.7,41.69 101.28,42.11 101.28,43.68 104.08,46.48 104.08,53.53 97.41,60.2 72.21,60.2 58.36,74.05 25.54,74.05 23.28,71.79
$1N12226: length 107.6
  Top Layer w0.254: 18.08,71.65 18.08,72.54 19.94,74.41 58.51,74.41 72.36,60.56 97.56,60.56 104.44,53.68 104.44,46.33 102.62,44.51 102.62,43.43
$1N12246: length 119.4
  Top Layer w0.254: 122.28,42.92 120.35,40.98 102.19,40.98 102.19,40.97 101.52,40.97 101.51,40.98 101.41,40.98 100.57,41.82 100.57,43.97 103.37,46.77 103.37,53.23 97.11,59.49 71.92,59.49 58.07,73.34 29.64,73.34 28.33,72.03
$1N12253: length 122.1
  Top Layer w0.254: 127.34,43.01 124.95,40.63 102.34,40.63 102.33,40.62 101.27,40.62 100.21,41.67 100.21,44.12 103.01,46.92 103.01,53.09 96.97,59.13 71.77,59.13 57.92,72.98 32.23,72.98 30.85,71.6
$1N12279: length 133.7
  Top Layer w0.254: 35.81,71.81 36.62,72.63 57.77,72.63 71.62,58.78 96.82,58.78 102.66,52.94 102.66,47.07 99.86,44.27 99.86,41.52 101.12,40.26 102.48,40.26 102.49,40.27 125.34,40.27 126.95,41.87 128.03,41.87 128.72,42.56 128.72,43.54 127.74,44.52 127.74,57.63
$1N12374: length 129.9
  Top Layer w0.254: 129.37,15.49 129.21,15.32 90.75,15.32 83.76,22.31 83.76,24.4 81.68,24.4 77.74,28.33 77.74,39.02 74.04,42.71 74.04,55.86 60.61,69.29 40.09,69.29 38.12,71.26 38.12,71.5
$1N15775: length 126.3
  Top Layer w0.254: 117.85,25.14 117.76,25.06 115.05,25.06
  Bottom Layer w0.254: 23.27,53.82 23.27,57.73 25.6,60.05 51.64,60.05 62.09,49.61 62.09,43.08 80.6,24.57 92.47,24.57 99.48,31.57 111.29,31.57 117.8,25.06
  vias: v5(117.81,25.1)
$1N15829: length 78
  Top Layer w0.254: 115.31,23.81 114.39,22.88 107.33,22.88 105.45,24.76 84.15,24.76 84.14,24.75 81.82,24.75 78.1,28.48 78.1,39.17 74.4,42.86 74.4,56.47 76.16,58.23 82.26,58.23
$1N18174: length 3.7
  Top Layer w0.254: 8,53.99 8,56.89 7.44,57.45
$1N23285: length 109.3
  Top Layer w0.254: v5(88.32,30.37) 88.32,32.49 91.47,35.63
  Bottom Layer w0.254: 88.34,30.34 87.6,30.34 75.85,42.08 75.85,77.09 69.5,83.44 38.95,83.44 31.27,75.76
$1N23296: length 113.6
  Top Layer w0.254: v5(89.19,36.96) 89.24,36.92 91.13,36.92 91.22,37
  Bottom Layer w0.254: 23.71,65.21 23.71,64.6 25.32,62.99 64.47,62.99 66.53,60.93 66.53,46.38 77.82,35.08 77.82,29.23 80.39,26.66 90.41,26.66 92.07,28.32 92.07,37.36 90.59,38.84 89.65,38.84 89.18,38.36 89.18,37 89.25,36.93

## Copper pours and planes (outline as drawn; the poured copper is in the pictures)
GND on Top Layer: -6.86,94.2 153.68,94.2 153.68,-6.48 -6.86,-6.48

## Text on the board
Bottom Silkscreen Layer: THIS DEVICE MAY / BECOME A SMOKE / MACHINE IF OPERATED / IMPROPERLY | OAK > SFO | vZOA | If you can see this, / put the Pico back on. | WARNING | -.-. --.-   -.-. --.-   -.-. --.- / -.. .   -.- --- -.... .-.. ...- -- | VATSIM - vatsim.net / vZOA - oakartcc.org / FlyByWire - flybywiresim.com / MobiFlight - mobiflight.com / Hack Club - hackclub.com / witherman3000 | 1929124 | WARNING: DO NOT LICK PCB. | THANKS TO: | RADIO MANAGEMENT PANEL | KO6LVM.org
Top Silkscreen Layer: MAIN FREQUENCY | SECONDARY FREQUENCY | 145.67 x 85.3 RMP | Made for the / FlyByWire Airbus A320neo | Front - Top | KO6LVM.org | de KO6LVM | A320 RMP v1
